# Altium project COMBINATION_M5ATOM_RELAY.PrjPcb
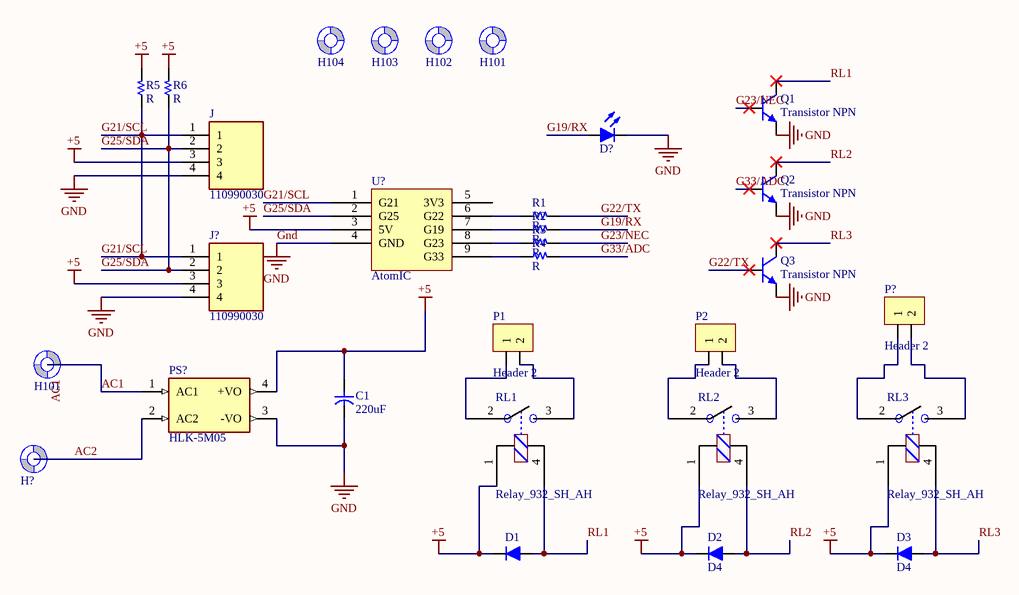
[diagram p0: SCH_COMB-ATOM-RELAY.SchDoc]
1 sheet, 30 parts. Net scope: global (net labels, ports and power ports of the same name join across sheets).
Board file: PCB_COMB-ATOM-RELAY.PcbDoc

## Sheet SCH_COMB-ATOM-RELAY.SchDoc
size A; SheetNumber: 1; SheetTotal: 1

### Parts
(Parts that share a designator on the sheet are numbered #1, #2 ... from top to bottom, then left to right.)
AC1  Screw Hole  [SCREW/3.0/6.0]  (value not drawn)  (no BOM)
C1  220uF  [C SMD ALU (F) DUAL]
D1  (no value)  [DO-214AC (SMA)]
D2  D4  [DO-214AC (SMA)]
D3  D4  [DO-214AC (SMA)]
D?  Led  [LED 5MM - GREEN]  (value not drawn)
H101#1  Screw Hole  [SCREW/2.8/5.0]  (value not drawn)  (no BOM)
H101#2  Screw Hole  [SCREW/3.0/6.0]  (value not drawn)  (no BOM)
H102  Screw Hole  [SCREW/2.8/5.0]  (value not drawn)  (no BOM)
H103  Screw Hole  [SCREW/2.8/5.0]  (value not drawn)  (no BOM)
H104  Screw Hole  [SCREW/2.8/5.0]  (value not drawn)  (no BOM)
J  110990030  [SEEED_110990030]
J?  110990030  [SEEED_110990030]
P1  Header 2  [HDR/Header/2/VH]
P2  Header 2  [HDR/Header/2/VH]
P?  Header 2  [HDR/Header/2/VH]
PS?  HLK-5M05  [CONV_HLK-5M05]
Q1  Transistor NPN  [SOT-23]
Q2  Transistor NPN  [SOT-23]
Q3  Transistor NPN  [SOT-23]
R1  R  [R 0805]
R2  R  [R 0805]
R3  R  [R 0805]
R4  R  [R 0805]
R5  R  [R 0805]
R6  R  [R 0805]
RL1  Relay_932_SH_AH  [RELAY932]
RL2  Relay_932_SH_AH  [RELAY932]
RL3  Relay_932_SH_AH  [RELAY932]
U?  AtomIC  [SPGA48x11]

### Nets
+5: C1.1 D1.2(K) D2.2(K) D3.2(K) J.3 J?.3 PS?.4(+VO) R5.2 R6.2 RL1.1 RL2.1 RL3.1 U?.3(5V)
Gnd: C1.2 D?.2(K) J.4 J?.4 PS?.3(-VO) Q1.2(E) Q2.2(E) Q3.2(E) U?.4(GND)
AC1: H101#2.1(Screw) PS?.1(AC1)
AC2: PS?.2(AC2)
G19/RX: D?.1(A) R2.2
G21/SCL: J.1 J?.1 R5.1 U?.1(G21)
G22/TX: Q3.1(B) R1.2
G23/NEC: Q1.1(B) R3.2
G25/SDA: J.2 J?.2 R6.1 U?.2(G25)
G33/ADC: Q2.1(B) R4.2
RL1: D1.1(A) Q1.3(C) RL1.4
RL2: D2.1(A) Q2.3(C) RL2.4
RL3: D3.1(A) Q3.3(C) RL3.4
NetP1_1: P1.1 RL1.2
NetP1_2: P1.2 RL1.3
NetP2_1: P2.1 RL2.2
NetP2_2: P2.2 RL2.3
NetP?_1: P?.1 RL3.2
NetP?_2: P?.2 RL3.3
NetR1_1: R1.1 U?.6(G22)
NetR2_1: R2.1 U?.7(G19)
NetR3_1: R3.1 U?.8(G23)
NetR4_1: R4.1 U?.9(G33)

Not connected (* = marked no-connect by the designer): AC1 1(Screw); H101#1 1(Screw); H102 1(Screw); H103 1(Screw); H104 1(Screw); U? 5(3V3)

### Library data of the parts
C1 = Capacitor: Capacitor pol
D1-D3 = Diode: Default Diode
D? = Led: Typical LED
J = 110990030: GROVE 2MM 4PIN VERT CONN 10PCS; MF: Seeed Technology; Arrow_Electronics-Purchase-URL: https://snapeda.com/shop?store=Arrow+Electronics&id=583576; Availability: Good; Package: None; Price: None; Mouser-Purchase-URL: https://snapeda.com/shop?store=Mouser&id=583576; MP: 110990030; SnapEDA_Link: https://www.snapeda.com/parts/110990030/Seeed%20Technology%20Co.,%20Ltd/view-part/583576/?ref=snap; Value: *; Check_prices: https://www.snapedacom/parts/110990030/Seeed%20Technology%20Co.,%20Ltd/view-part/583576/?ref=eda
J? = 110990030: MF: Seeed Technology; Arrow_Electronics-Purchase-URL: https://snapeda.com/shop?store=Arrow+Electronics&id=583576; Availability: Good; Package: None; Price: None; Mouser-Purchase-URL: https://snapeda.com/shop?store=Mouser&id=583576; MP: 110990030; SnapEDA_Link: https://www.snapeda.com/parts/110990030/Seeed%20Technology%20Co.,%20Ltd/view-part/583576/?ref=snap; Value: *; Check_prices: https://www.snapeda.com/parts/110990030/Seeed%20Technology%20Co.,%20Ltd/view-part/583576/?ref=eda
P1 P2 P? = Header 2: Header, 2-Pin
PS? = HLK-5M05: AC DC 220V to 5V 5W 5Watt Isolated Switching Step-Down Power Supply Module Converter; MF: Hi-link; Check_prices: https://www.snapeda.com/parts/HLK-5M05/Hi-link/view-part/?ref=eda; SnapEDA_Link: https://www.snapeda.com/parts/HLK-5M05/Hi-link/view-part/?ref=snap; Price: None; Availability: Not in stock; Package: Package; MP: HLK-5M05; Value: *
Q1-Q3 = Transistor NPN: NPN Bipolar Transistor
R1-R6 = Resistor
H101#1 H101#2 H102-H104 H? = Screw Hole: TYPE: NO-BOM; UNIT PRICE: 0